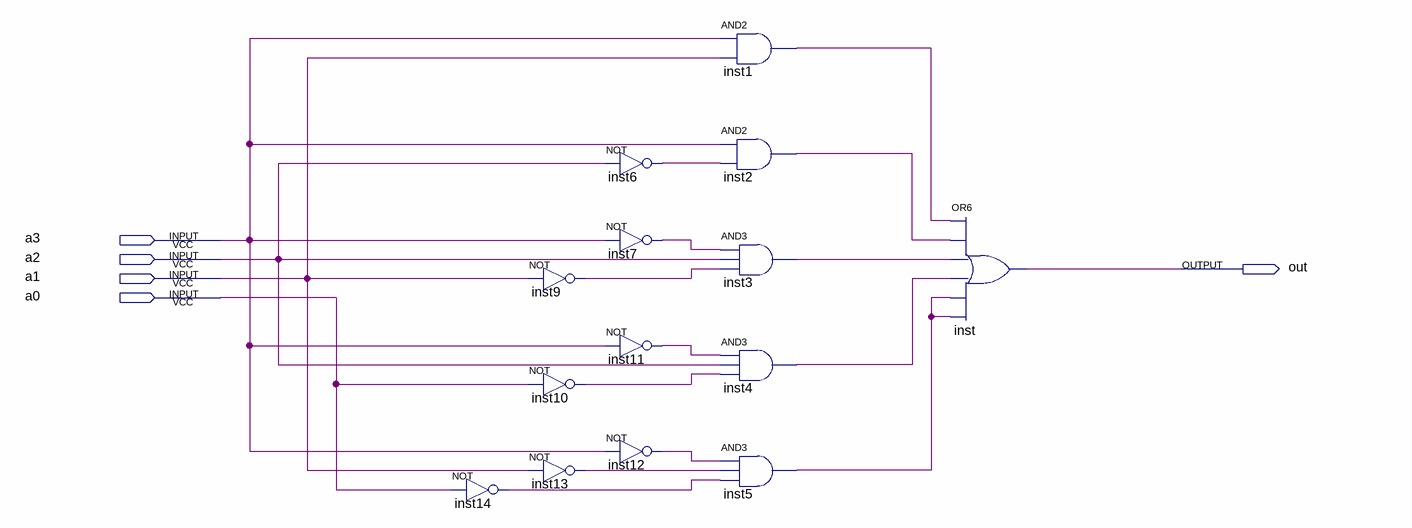
[diagram p0: schematic sheet]
// Quartus schematic FuncF.bdf as structural Verilog: 14 symbols, 5 pins
module FuncF (
  input  a3,
  input  a2,
  input  a1,
  input  a0,
  output out
);

  wire inst1_out, inst2_out, inst3_out, inst4_out, inst5_out, inst6_out, inst7_out, inst9_out, inst10_out,
       inst11_out, inst12_out, inst13_out, inst14_out;

  not inst14 (inst14_out, a0);
  not inst9 (inst9_out, a1);
  not inst10 (inst10_out, a0);
  not inst13 (inst13_out, a1);
  not inst6 (inst6_out, a2);
  not inst7 (inst7_out, a3);
  not inst11 (inst11_out, a3);
  not inst12 (inst12_out, a3);
  and inst1 (inst1_out, a3, a1);
  and inst2 (inst2_out, a3, inst6_out);
  and inst3 (inst3_out, inst7_out, a2, inst9_out);
  and inst4 (inst4_out, inst11_out, a2, inst10_out);
  and inst5 (inst5_out, inst12_out, inst13_out, inst14_out);
  or inst (out, inst1_out, inst2_out, inst3_out, inst4_out, inst5_out, inst5_out);
endmodule
